# Altium project EMP_Drone_Flight_Controller.PrjPcb (part 2 of 2)

## Sheet Motor_Outputs.SchDoc
size OrCAD A; SheetNumber: 5; SheetTotal: 5
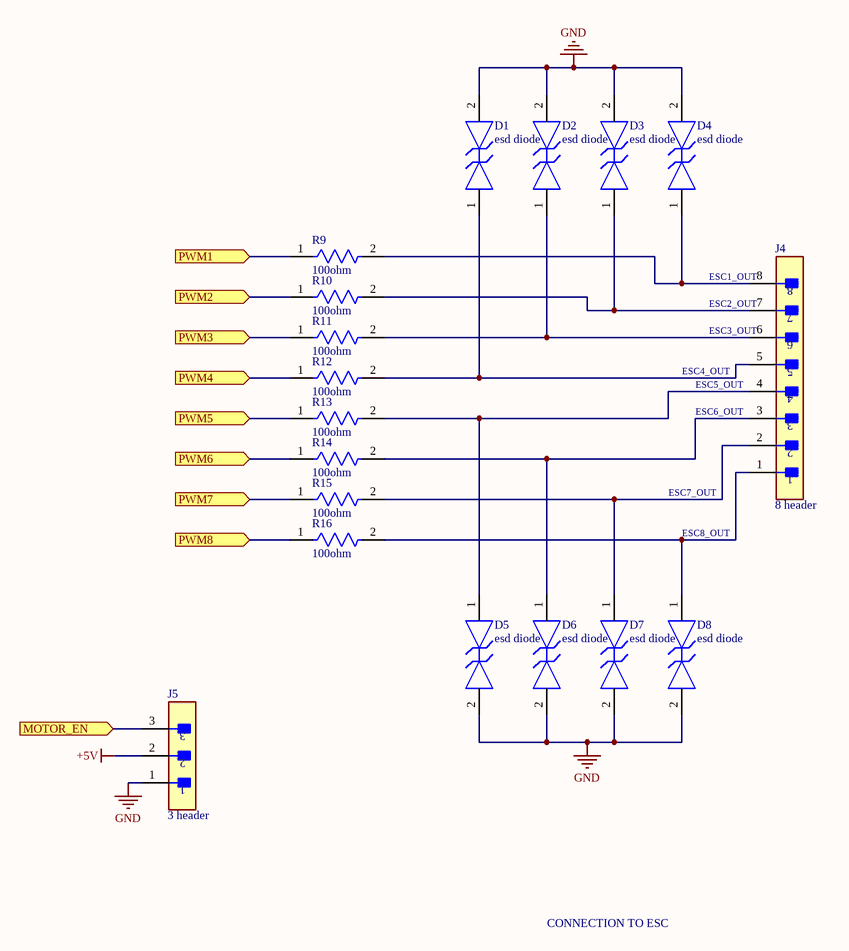
[diagram p4: Motor_Outputs.SchDoc]

### Parts
D1  esd diode  [FP-152AF-MFG]
D2  esd diode  [FP-152AF-MFG]
D3  esd diode  [FP-152AF-MFG]
D4  esd diode  [FP-152AF-MFG]
D5  esd diode  [FP-152AF-MFG]
D6  esd diode  [FP-152AF-MFG]
D7  esd diode  [FP-152AF-MFG]
D8  esd diode  [FP-152AF-MFG]
J4  8 header  [FP-B8B-XH-A_LF_SN-MFG]
J5  3 header  [FP-B3B-XH-AM_LF_SN-MFG]
R9  100ohm  [FP-RNCP0603-MFG]
R10  100ohm  [FP-RNCP0603-MFG]
R11  100ohm  [FP-RNCP0603-MFG]
R12  100ohm  [FP-RNCP0603-MFG]
R13  100ohm  [FP-RNCP0603-MFG]
R14  100ohm  [FP-RNCP0603-MFG]
R15  100ohm  [FP-RNCP0603-MFG]
R16  100ohm  [FP-RNCP0603-MFG]

### Ports
MOTOR_EN (in, see EMP_FC_Main[3C], MCU_Core[3B]), PWM1 (in, see EMP_FC_Main[2C], MCU_Core[3B]), PWM2 (in, see EMP_FC_Main[2C], MCU_Core[3B]), PWM3 (in, see EMP_FC_Main[2C], MCU_Core[3B]), PWM4 (in, see EMP_FC_Main[2C], MCU_Core[3B]), PWM5 (in, see EMP_FC_Main[2C], MCU_Core[3B]), PWM6 (in, see EMP_FC_Main[2C], MCU_Core[3B]), PWM7 (in, see EMP_FC_Main[2C], MCU_Core[3B]), PWM8 (in, see EMP_FC_Main[3C], MCU_Core[5B])

### Nets
+5V: J5.2
GND: D1.2 D2.2 D3.2 D4.2 D5.2 D6.2 D7.2 D8.2 J5.1
NetD1_1: D1.1 J4.5 R12.2
NetD2_1: D2.1 J4.6 R11.2
NetD3_1: D3.1 J4.7 R10.2
NetD4_1: D4.1 J4.8 R9.2
NetD5_1: D5.1 J4.4 R13.2
NetD6_1: D6.1 J4.3 R14.2
NetD7_1: D7.1 J4.2 R15.2
NetD8_1: D8.1 J4.1 R16.2
NetJ5_3: J5.3 ; port MOTOR_EN
NetR9_1: R9.1 ; port PWM1
NetR10_1: R10.1 ; port PWM2
NetR11_1: R11.1 ; port PWM3
NetR12_1: R12.1 ; port PWM4
NetR13_1: R13.1 ; port PWM5
NetR14_1: R14.1 ; port PWM6
NetR15_1: R15.1 ; port PWM7
NetR16_1: R16.1 ; port PWM8

### Notes on the sheet
- (near J4) ESC1_OUT
- (near J4) ESC2_OUT
- ESC4_OUT
- (near J4) ESC5_OUT
- (near J4) ESC3_OUT
- (near J4) ESC6_OUT
- ESC7_OUT
- ESC8_OUT
- CONNECTION TO ESC

### Library data of the parts
D1-D8 = CMP-07200-000010-1: TVS DIODE 5.3V 14V 2X3DFN; Number of Bidirectional Channels: 1; Element Configuration: Single; Capacitance: 0.3pF; Peak Pulse Current: 3A; Power Line Protection: No; Min Breakdown Voltage: 7V; Direction: Bidirectional; Case/Package: DFN; Lead Free: Lead Free; Reverse Standoff Voltage: 5.3V; Clamping Voltage: 14V; Resistor Type: Zener; Packaging: Tape and Reel; Mount: Surface Mount; Number of Pins: 2; Max Operating Temperature: 150°C; Min Operating Temperature: -55°C; Working Voltage: 5.3V; RoHS Compliant: Yes
J4 = CMP-17438-000015-1: CONN HEADER VERT 8POS 2.5MM; Voltage Rating (AC): 250V; Insulation Resistance: 1GR; Connector Type: Male Pin; Max Current Rating: 3A; Wire/Cable Gauge: 22AWG; Number of Contacts: 8; Contact Resistance: 20mR; Orientation: Straight; Pitch: 2.5mm; Min Operating Temperature: -25°C; Number of Rows: 1; Contact Type: Male Pin; Packaging: Bulk; Lead Free: Lead Free; Max Operating Temperature: 85°C; Housing Material: Polyamide; Voltage Rating: 250V; Series: XH; Mount: Through Hole; Depth: 5.75mm; Contact Material: Brass; Fastening Type: Detent; Color: Natural; Max Voltage Rating (AC): 250V; Number of Positions: 8; Housing Color: White; Contact Plating: Tin; Lead Pitch: 2.5mm; Length: 22.4mm; REACH SVHC: No SVHC; Termination: Press-Fit; Current Rating: 3A
J5 = CMP-17438-000009-1: CONN HEADER VERT 3POS 2.5MM; Max Current Rating: 3A; Gender: Male; Max Voltage Rating (AC): 250V; Connector Type: Male Pin; Pitch: 0.098inch; Number of Positions: 3; Contact Resistance: 20mR; Termination: Press-Fit; Housing Color: White; Housing Material: Polyamide; Orientation: Straight; Contact Material: Brass; Contact Type: Male Pin; Color: Natural; Packaging: Bulk; Lead Free: Lead Free; Depth: 5.75mm; Number of Rows: 1; Contact Plating: Tin; Length: 9.9mm; Max Operating Temperature: 85°C; Series: XH; Min Operating Temperature: -25°C; Fastening Type: Detent; Mount: Through Hole
R9-R16 = CMP-26527-000148-1: 100Ω ±1% 0.125W 0603 High Power Anti-Sulfur Thin Film Chip Resistor; Resistance: 100R; Temperature Coefficient: 100ppm/°C; Max Power Dissipation: 125mW; Features: Moisture Resistant; Packaging: Tape and Reel; Lead Free: Lead Free; Height: 0.02inch; Series: RNCP; Contact Plating: Tin; Resistor Type: Thin Film; Case Code (Imperial): 0603; Case Code (Metric): 1608; Min Operating Temperature: -55°C; Length: 0.059inch; Number of Terminations: 2; RoHS Compliant: Yes; Tolerance: 1%; Width: 0.031inch; Max Operating Temperature: 155°C; Case/Package: 0603; Mount: Surface Mount; Radiation Hardening: No

## Nets that join several sheets
+3V3_ANALOG: Power_Management (C50.1 U11.5), MCU_Core (31 pins)
+3V3_MAIN: Power_Management (7 pins), MCU_Core (20 pins), Communication (18 pins)
+5V: Power_Management (14 pins), Communication (J2.2 P2.1), Motor_Outputs (J5.2)
GND: Power_Management (33 pins), MCU_Core (55 pins), Communication (24 pins), Motor_Outputs (9 pins)
D_N: MCU_Core (U2.70), Communication (J3.3)
D_P: MCU_Core (U2.71), Communication (J3.2)
LMSCL: Power_Management (R37.2 U10.5), MCU_Core (5 pins)
LMSDA: Power_Management (R38.2 U10.4), MCU_Core (5 pins)
NetJ5_3: MCU_Core (U2.97), Motor_Outputs (J5.3)
NetMD1_3: MCU_Core (U2.24), Communication (MD1.3)
NetMD1_20: MCU_Core (U2.23), Communication (MD1.20)
NetMD1_21: MCU_Core (U2.22), Communication (MD1.21)
NetP1_2: MCU_Core (U2.92), Communication (P1.2)
NetP1_3: MCU_Core (U2.93), Communication (P1.3)
NetP2_2: MCU_Core (U2.68), Communication (P2.2)
NetP2_3: MCU_Core (U2.69), Communication (P2.3)
NetR9_1: MCU_Core (U2.38), Motor_Outputs (R9.1)
NetR10_1: MCU_Core (U2.39), Motor_Outputs (R10.1)
NetR11_1: MCU_Core (U2.40), Motor_Outputs (R11.1)
NetR12_1: MCU_Core (U2.41), Motor_Outputs (R12.1)
NetR13_1: MCU_Core (U2.43), Motor_Outputs (R13.1)
NetR14_1: MCU_Core (U2.44), Motor_Outputs (R14.1)
NetR15_1: MCU_Core (U2.45), Motor_Outputs (R15.1)
NetR16_1: MCU_Core (U2.34), Motor_Outputs (R16.1)
NetR42_1: Power_Management (R42.1 R44.2), MCU_Core (U2.1)
NetU1_14: MCU_Core (U2.55), Communication (U1.14)
NetU1_15: MCU_Core (U2.56), Communication (U1.15)
NetU2_98: Power_Management (U7.1), MCU_Core (U2.98)